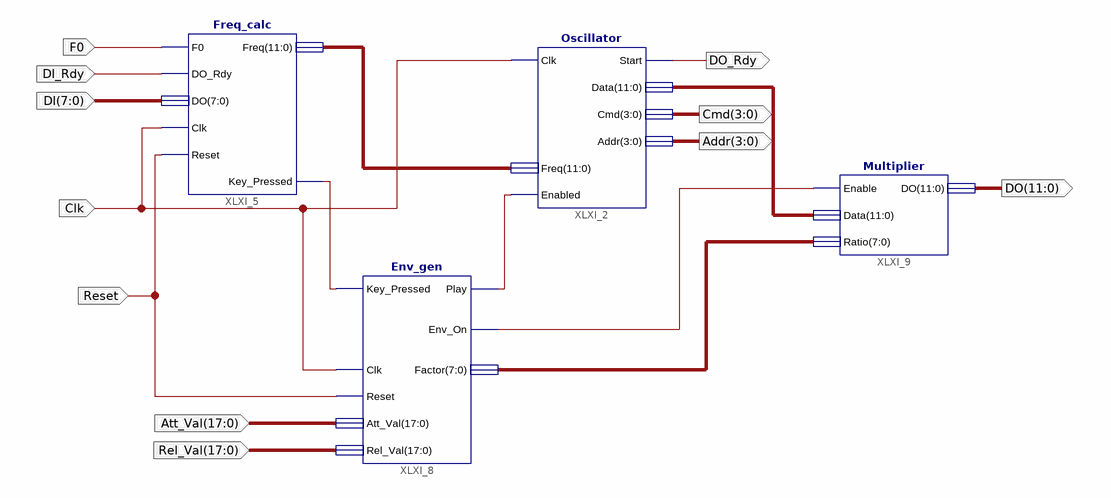
[diagram p0: schematic sheet 1]
// Xilinx ISE schematic TestScheme_Freq_calcAndOscillator.sch (spartan3e) as structural Verilog: 4 symbols, 11 ports
module TestScheme_Freq_calcAndOscillator (
  input  [7:0] DI,
  input  DI_Rdy,
  input  F0,
  input  Clk,
  input  [17:0] Att_Val,
  input  [17:0] Rel_Val,
  input  Reset,
  output DO_Rdy,
  output [3:0] Cmd,
  output [3:0] Addr,
  output [11:0] DO
);

  wire XLXN_16, XLXN_18, XLXN_35;
  wire [7:0] XLXN_34;
  wire [11:0] XLXN_1, XLXN_36;

  Freq_calc XLXI_5 (.F0(F0), .DO_Rdy(DI_Rdy), .Clk(Clk), .Reset(Reset), .DO(DI), .Key_Pressed(XLXN_16), .Freq(XLXN_1));
  Oscillator XLXI_2 (
    .Clk(Clk), .Freq(XLXN_1), .Start(DO_Rdy), .Data(XLXN_36), .Cmd(Cmd), .Addr(Addr), .Enabled(XLXN_18));
  Env_gen XLXI_8 (
    .Key_Pressed(XLXN_16), .Clk(Clk), .Play(XLXN_18), .Env_On(XLXN_35), .Factor(XLXN_34), .Reset(Reset),
    .Att_Val(Att_Val), .Rel_Val(Rel_Val));
  Multiplier XLXI_9 (.Enable(XLXN_35), .Data(XLXN_36), .Ratio(XLXN_34), .DO(DO));
endmodule
